# EAGLE design untitled (EAGLE 9.3.2)
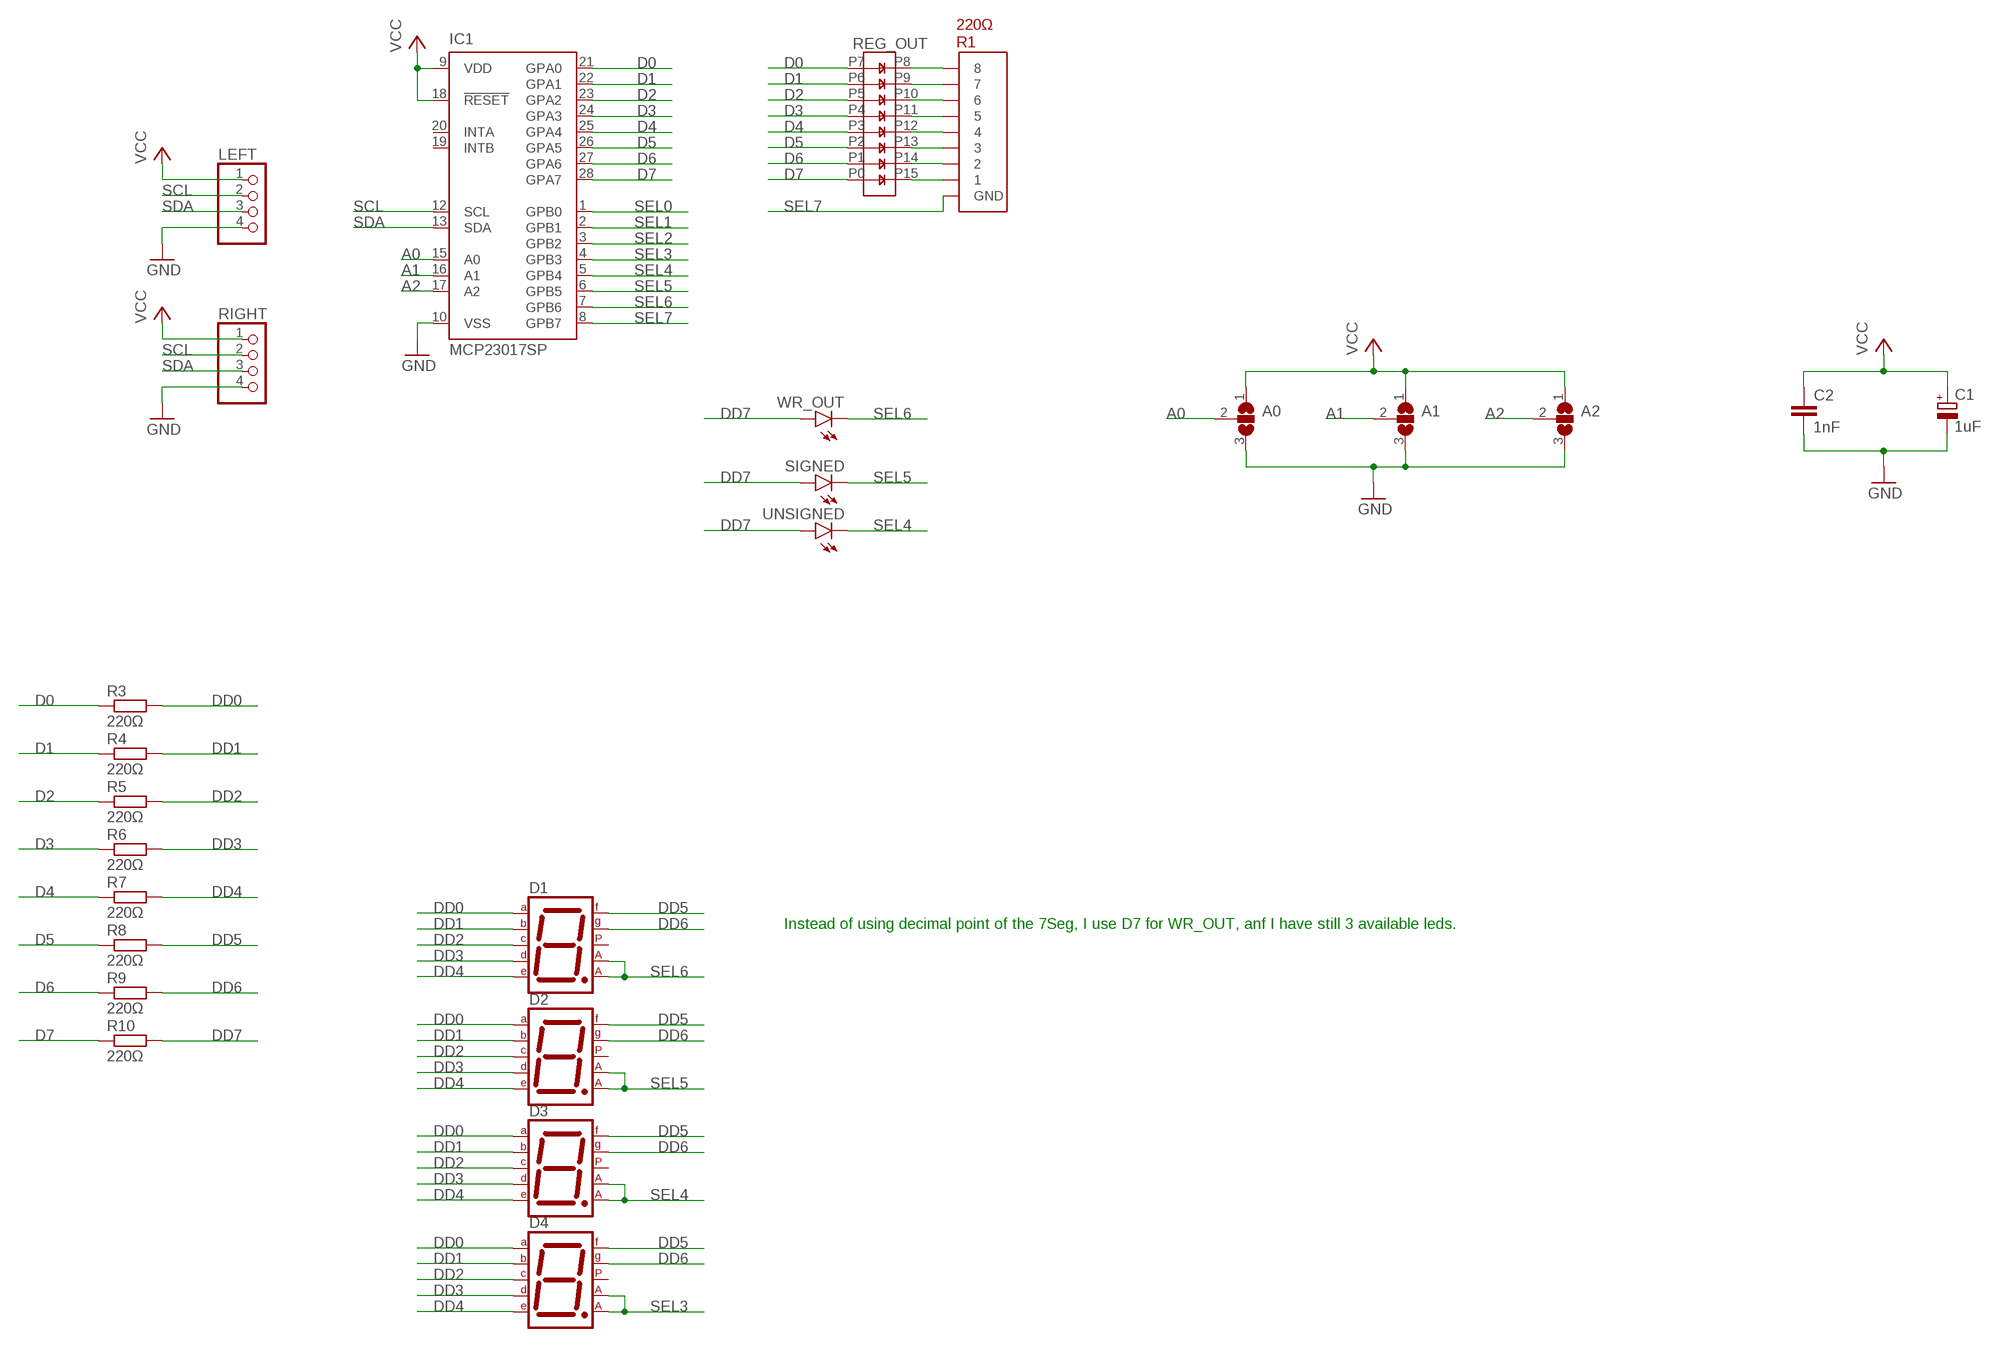
[diagram p0: schematic, sheet 1]

## Parts
A0  SJ2W  [SJ_2]
A1  SJ2W  [SJ_2]
A2  SJ2W  [SJ_2]
C1  1uF  CPOL-EUE2.5-6  [E2,5-6]
C2  1nF  C2.5/2  [C2.5-2]
D1  7SEG-CA  [7SEG-13]
D2  7SEG-CA  [7SEG-13]
D3  7SEG-CA  [7SEG-13]
D4  7SEG-CA  [7SEG-13]
IC1  MCP23017SP  [DIL28-3]
LEFT  PINHD-1X4  [1X04]
R1  220Ω  R_ARRAY_8PIN  [R_ARRAY_8PIN]
R3  220Ω  R-EU_0207/10  [0207/10]
R4  220Ω  R-EU_0207/10  [0207/10]
R5  220Ω  R-EU_0207/10  [0207/10]
R6  220Ω  R-EU_0207/10  [0207/10]
R7  220Ω  R-EU_0207/10  [0207/10]
R8  220Ω  R-EU_0207/10  [0207/10]
R9  220Ω  R-EU_0207/10  [0207/10]
R10  220Ω  R-EU_0207/10  [0207/10]
REG_OUT  LB8  [LB8]
RIGHT  PINHD-1X4  [1X04]
SIGNED  LED3MM  [LED3MM]
UNSIGNED  LED3MM  [LED3MM]
WR_OUT  LED3MM  [LED3MM]

## Nets
A0: A0.2 IC1.15(A0)
A1: A1.2 IC1.16(A1)
A2: A2.2 IC1.17(A2)
D0: IC1.21(GPA0) R3.1 REG_OUT.P7
D1: IC1.22(GPA1) R4.1 REG_OUT.P6
D2: IC1.23(GPA2) R5.1 REG_OUT.P5
D3: IC1.24(GPA3) R6.1 REG_OUT.P4
D4: IC1.25(GPA4) R7.1 REG_OUT.P3
D5: IC1.26(GPA5) R8.1 REG_OUT.P2
D6: IC1.27(GPA6) R9.1 REG_OUT.P1
D7: IC1.28(GPA7) R10.1 REG_OUT.P0
DD0: D1.7(A) D2.7(A) D3.7(A) D4.7(A) R3.2
DD1: D1.6(B) D2.6(B) D3.6(B) D4.6(B) R4.2
DD2: D1.4(C) D2.4(C) D3.4(C) D4.4(C) R5.2
DD3: D1.2(D) D2.2(D) D3.2(D) D4.2(D) R6.2
DD4: D1.1(E) D2.1(E) D3.1(E) D4.1(E) R7.2
DD5: D1.9(F) D2.9(F) D3.9(F) D4.9(F) R8.2
DD6: D1.10(G) D2.10(G) D3.10(G) D4.10(G) R9.2
DD7: R10.2 SIGNED.A UNSIGNED.A WR_OUT.A
GND: A0.3 A1.3 A2.3 C1.- C2.2 IC1.10(VSS) LEFT.4 RIGHT.4
N$17: R1.8 REG_OUT.P8
N$18: R1.7 REG_OUT.P9
N$19: R1.6 REG_OUT.P10
N$20: R1.5 REG_OUT.P11
N$21: R1.4 REG_OUT.P12
N$22: R1.3 REG_OUT.P13
N$23: R1.2 REG_OUT.P14
N$24: R1.1 REG_OUT.P15
SCL: IC1.12(SCL) LEFT.2 RIGHT.2
SDA: IC1.13(SDA) LEFT.3 RIGHT.3
SEL0: IC1.1(GPB0)
SEL1: IC1.2(GPB1)
SEL2: IC1.3(GPB2)
SEL3: D4.3(CA1) D4.8(CA2) IC1.4(GPB3)
SEL4: D3.3(CA1) D3.8(CA2) IC1.5(GPB4) UNSIGNED.K(C)
SEL5: D2.3(CA1) D2.8(CA2) IC1.6(GPB5) SIGNED.K(C)
SEL6: D1.3(CA1) D1.8(CA2) IC1.7(GPB6) WR_OUT.K(C)
SEL7: IC1.8(GPB7) R1.GND
VCC: A0.1 A1.1 A2.1 C1.+ C2.1 IC1.9(VDD) IC1.18(!RESET) LEFT.1 RIGHT.1
Unconnected: D1.5(DP) D2.5(DP) D3.5(DP) D4.5(DP) IC1.19(INTB) IC1.20(INTA)

## Notes on the sheet
- Instead of using decimal point of the 7Seg, I use D7 for WR_OUT, anf I have still 3 available leds.

## Library data of the parts
A0 A1 A2 = jumper:SJ2W: SMD solder JUMPER
C1 = rcl:CPOL-EU: POLARIZED CAPACITOR, European symbol; SPICEPREFIX: C
C2 = capacitor-wima:C: CAPACITOR naming: grid - package width
D1-D4 = special:7SEG-CA: 7-segment DISPLAY single anode, 13 mm
IC1 = microchip:MCP23017: http://ww1.microchip.com/downloads/en/DeviceDoc/21952a.pdf Source: http://ww1.microchip.com/downloads/en/DeviceDoc/21952a.pdf; MF: MICROCHIP; MPN: MCP23017-E/SP; OC_FARNELL: 1332088; OC_NEWARK: 31K2959
LEFT RIGHT = pinhead:PINHD-1X4: PIN HEADER
R1 = 8bit_components:R_ARRAY_8PIN
R3-R10 = rcl:R-EU_: RESISTOR, European symbol; SPICEPREFIX: R
REG_OUT = 8bit_components:LB8
SIGNED UNSIGNED WR_OUT = led:LED: LED OSRAM: - CHIPLED LG R971, LG N971, LY N971, LG Q971, LY Q971, LO R971, LY R971 LH N974, LH R974 LS Q976, LO Q976, LY Q976 LO Q996 - Hyper CHIPLED LW Q18S LB Q993, LB Q99A, LB R99A - SideLED LS A670, LO A670, LY A670, LG A670, LP A670 LB A673, LV A673, LT A673, LW A673 LH A674 LY A675 LS A676, LA A676, LO A676, LY A676, LW A676 LS A679, LY A679, LG A679 - Hyper Micro SIDELED® LS Y876, LA Y876, LO Y876, LY Y876 LT Y87S - SmartLED LW L88C, LW L88S LB L89C, LB L89S, LG L890 LS L89K, LO L89K, LY L89K LS L896, LA L896, LO L896, LY L896 - TOPLED LS T670, LO T670, LY T670, LG T670, LP T670 LSG T670, LSP T670, LSY T670, LOP T670, LYG T670 LG T671, LOG T671, LSG T671 LB T673, LV T673, LT T673, LW T673 LH T674 LS T676, LA T676, LO T676, LY T676, LB T676, LH T676, LSB T676, LW T676 LB T67C, LV T67C, LT T67C, LS T67K, LO T67K, LY T67K, LW E67C LS E67B, LA E67B, LO E67B, LY E67B, LB E67C, LV E67C, LT E67C LW T67C LS T679, LY T679, LG T679 LS T770, LO T770, LY T770, LG T770, LP T770 LB T773, LV T773, LT T773, LW T773 LH T774 LS E675, LA E675, LY E675, LS T675 LS T776, LA T776, LO T776, LY T776, LB T776 LHGB T686 LT T68C, LB T68C - Hyper Mini TOPLED® LB M676 - Mini TOPLED Santana® LG M470 LS M47K, LO M47K, LY M47K Source: http://www.osram.convergy.de LUXEON: - LUMILED® LXK2-PW12-R00, LXK2-PW12-S00, LXK2-PW14-U00, LXK2-PW14-V00 LXK2-PM12-R00, LXK2-PM12-S00, LXK2-PM14-U00 LXK2-PE12-Q00, LXK2-PE12-R00, LXK2-PE12-S00, LXK2-PE14-T00, LXK2-PE14-U00 LXK2-PB12-K00, LXK2-PB12-L00, LXK2-PB12-M00, LXK2-PB14-N00, LXK2-PB14-P00, LXK2-PB14-Q00 LXK2-PR12-L00, LXK2-PR12-M00, LXK2-PR14-Q00, LXK2-PR14-R00 LXK2-PD12-Q00, LXK2-PD12-R00, LXK2-PD12-S00 LXK2-PH12-R00, LXK2-PH12-S00 LXK2-PL12-P00, LXK2-PL12-Q00, LXK2-PL12-R00 Source: www.luxeon.com KINGBRIGHT: KA-3528ASYC Source: www.kingbright.com

## Board
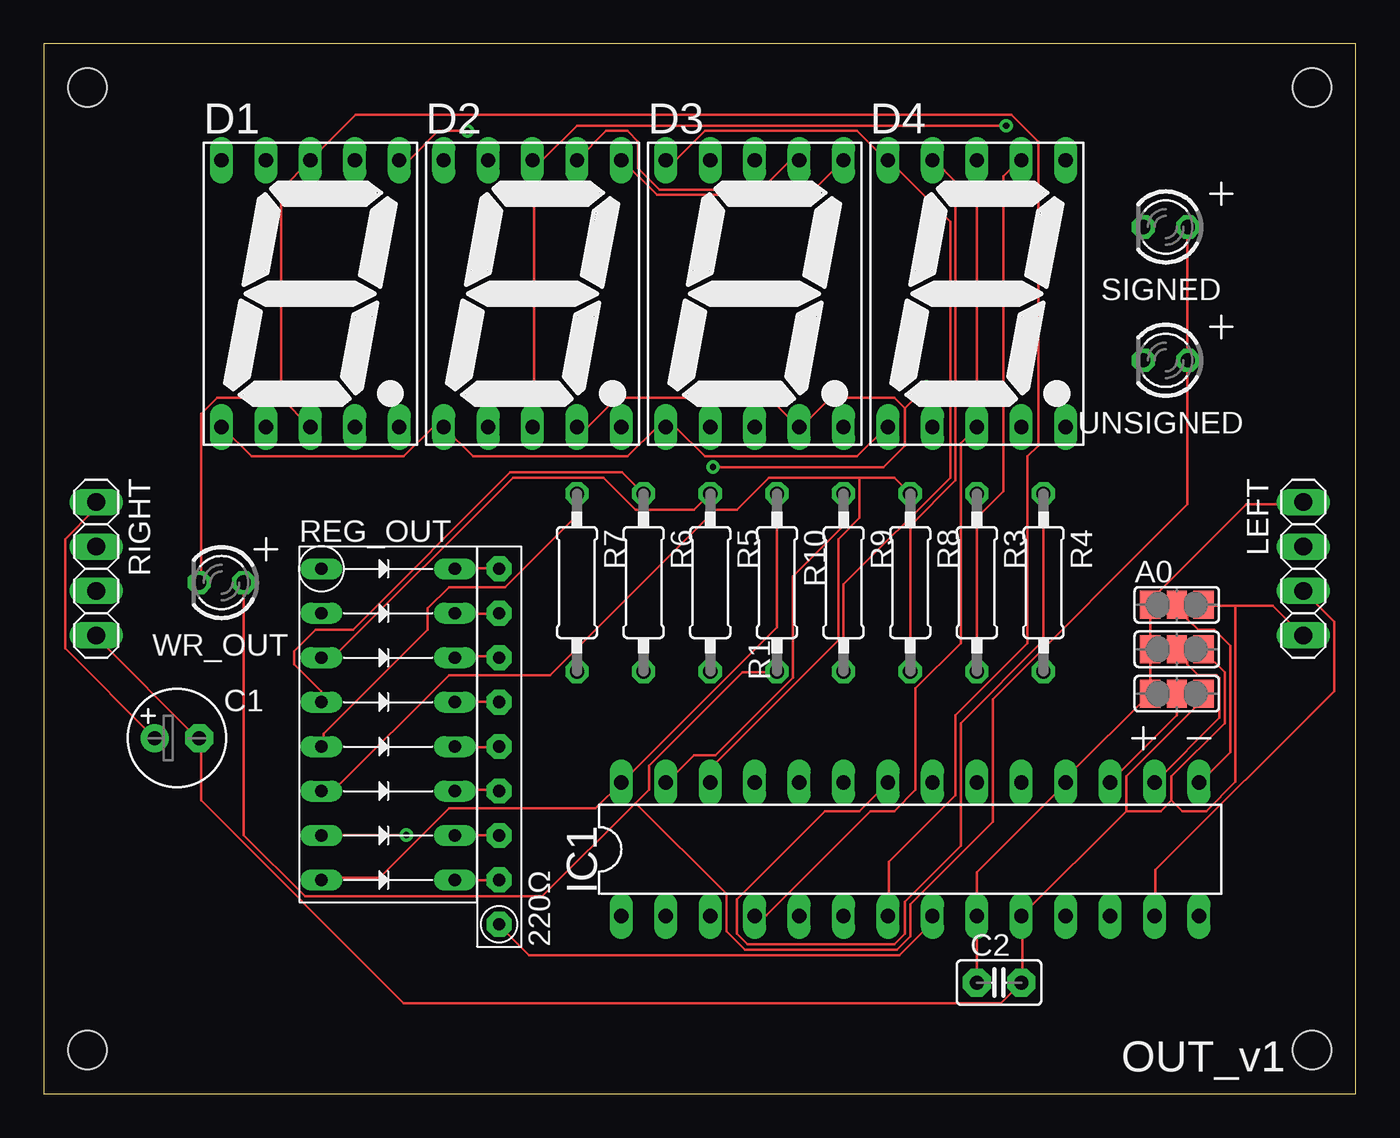
[diagram p1: board, top side]
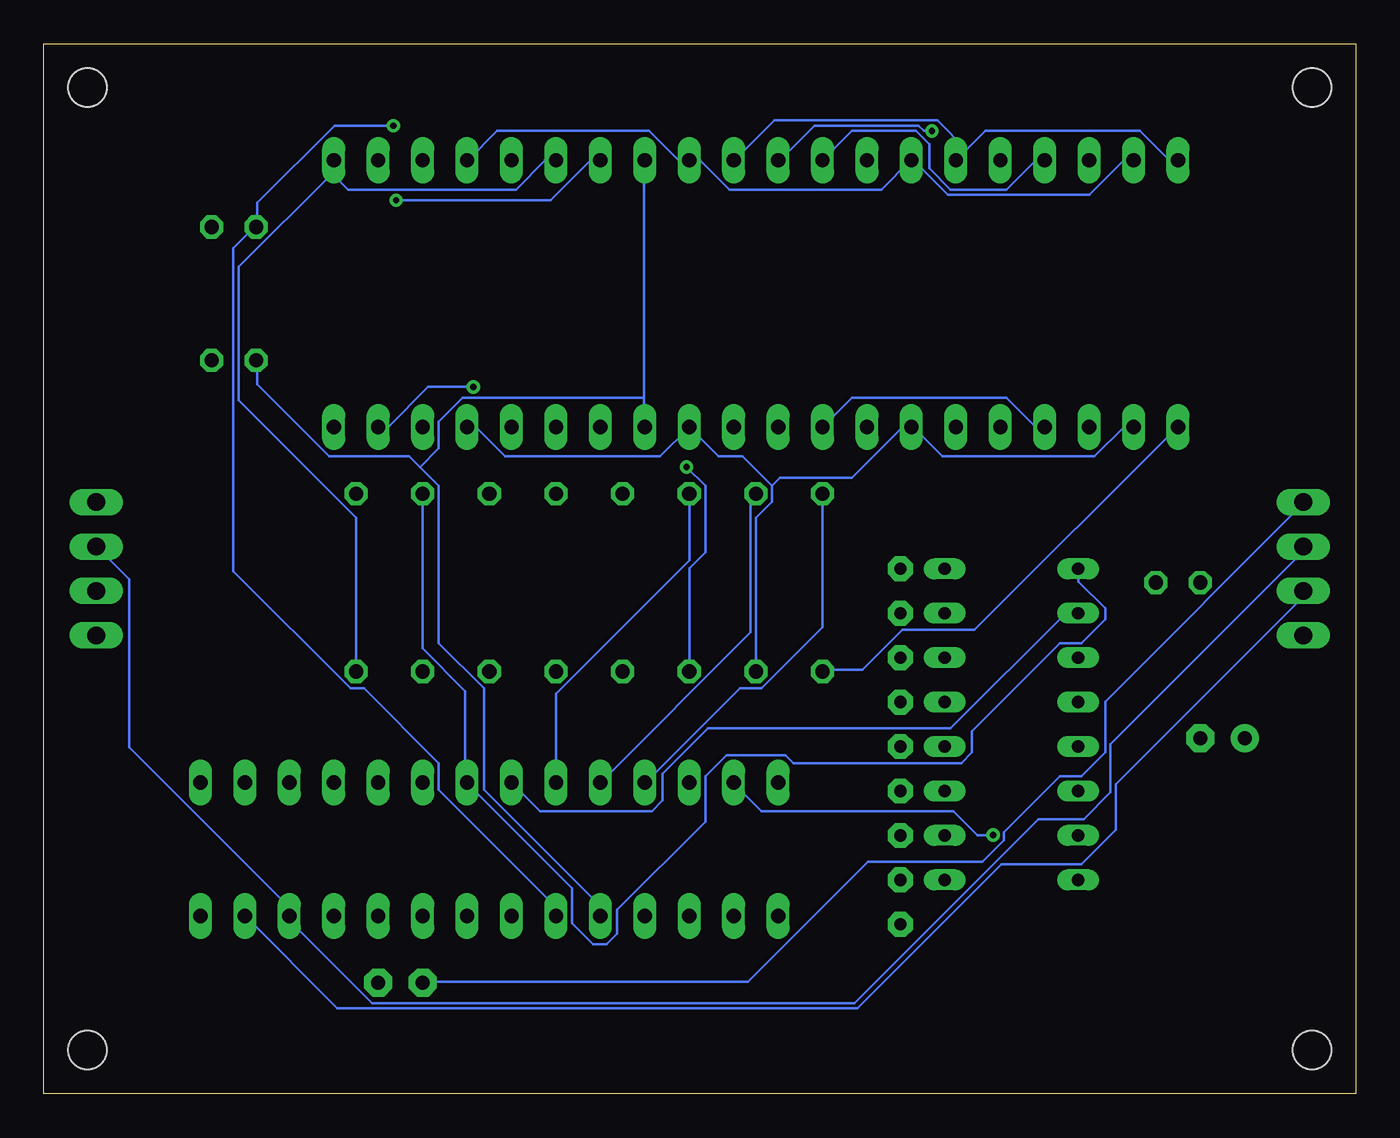
[diagram p2: board, bottom side, seen from below]

Size 75 x 60 mm. Coordinates in mm from the lower left corner, seen from the top.
Outline: 0,0 75,0 75,60 0,60 0,0
Copper layers (1*16): Top 0.035mm / dielectric 1.5mm / Bottom 0.035mm
Design rules "default": minimum track width 6mil, minimum drill 0.35mm, track to track 6mil, track to pad 6mil, pad to pad 6mil, via to via 6mil, smd to smd 6mil, copper to edge 40mil, drill to drill 6mil, minimum pad ring 10mil, minimum via ring 8mil, stop-mask expansion 4mil, vias tented up to drill 0mil, thermal gap 10mil
Holes 2.2 mm at 2.5,2.5 72.5,2.5 72.5,57.5 2.5,57.5
vRestrict: area 61,20.3 to 68.6,30.5

### Footprints (pad centres in the part's own frame; a part is rotated, then mirrored left to right if it is on the bottom)
SJ_2 = smd 1.168 x 1.6: 1 -1.524,0; 2 0,0; 3 1.524,0
E2,5-6 = drill 0.813 pad 1.6: + -1.27,0 | drill 0.813 pad 1.6 octagon: - 1.27,0
C2.5-2 = drill 0.813 pad 1.6 octagon: 1 -1.27,0; 2 1.27,0
7SEG-13 = drill 0.813 long: 1 -5.08,-7.62; 2 -2.54,-7.62; 3 0,-7.62; 4 2.54,-7.62; 5 5.08,-7.62; 6 5.08,7.62; 7 2.54,7.62; 8 0,7.62; 9 -2.54,7.62; 10 -5.08,7.62
DIL28-3 = drill 0.813 long: 1 -16.51,-3.81; 2 -13.97,-3.81; 3 -11.43,-3.81; 4 -8.89,-3.81; 5 -6.35,-3.81; 6 -3.81,-3.81; 7 -1.27,-3.81; 8 1.27,-3.81; 9 3.81,-3.81; 10 6.35,-3.81; 11 8.89,-3.81; 12 11.43,-3.81; 13 13.97,-3.81; 14 16.51,-3.81; 15 16.51,3.81; 16 13.97,3.81; 17 11.43,3.81; 18 8.89,3.81; 19 6.35,3.81; 20 3.81,3.81; 21 1.27,3.81; 22 -1.27,3.81; 23 -3.81,3.81; 24 -6.35,3.81; 25 -8.89,3.81; 26 -11.43,3.81; 27 -13.97,3.81; 28 -16.51,3.81
1X04 = drill 1.016 long: 1 -3.81,0; 2 -1.27,0; 3 1.27,0; 4 3.81,0
R_ARRAY_8PIN = drill 0.7 pad 1.422 octagon: 1 0,-7.62; 2 0,-5.08; 3 0,-2.54; 4 0,0; 5 0,2.54; 6 0,5.08; 7 0,7.62; 8 0,10.16; GND 0,-10.16
0207/10 = drill 0.813 octagon: 1 -5.08,0; 2 5.08,0
LB8 = drill 0.7 long: P0 -3.81,-8.89; P1 -3.81,-6.35; P2 -3.81,-3.81; P3 -3.81,-1.27; P4 -3.81,1.27; P5 -3.81,3.81; P6 -3.81,6.35; P7 -3.81,8.89; P8 3.81,8.89; P9 3.81,6.35; P10 3.81,3.81; P11 3.81,1.27; P12 3.81,-1.27; P13 3.81,-3.81; P14 3.81,-6.35; P15 3.81,-8.89
LED3MM = drill 0.813 octagon: A -1.27,0; K 1.27,0

### Placement (x,y rotation side)
A0  64.77,27.94 0 top
A1  64.77,25.4 0 top
A2  64.77,22.86 0 top
C1  7.62,20.32 0 top
C2  54.61,6.35 0 top
D1  15.24,45.72 0 top
D2  27.94,45.72 0 top
D3  40.64,45.72 0 top
D4  53.34,45.72 0 top
IC1  49.53,13.97 0 top
LEFT  72,30 270 top
R1  26.04,19.84 0 top
R3  53.34,29.21 270 top
R4  57.15,29.21 270 top
R5  38.1,29.21 270 top
R6  34.29,29.21 270 top
R7  30.48,29.21 270 top
R8  49.53,29.21 270 top
R9  45.72,29.21 270 top
R10  41.91,29.21 270 top
REG_OUT  19.68,21.11 0 top
RIGHT  3,30 270 top
SIGNED  64.14,49.53 180 top
UNSIGNED  64.14,41.91 180 top
WR_OUT  10.16,29.21 180 top

### Tracks (layer width: path | path; a pad name or v marks a point on that pad's centre or on a via)
A0
  Top 0.152: A0.2 64.77,27.89 65.38,27.28 65.38,27.13 65.99,26.52 66.9,26.52 67.82,25.6 67.82,19.51 66.14,17.83 IC1.15
A1
  Top 0.152: IC1.16 67.21,21.49 67.21,23.77 67.06,23.93 65.99,23.93 65.38,24.54 65.38,24.69 64.77,25.3 A1.2
A2
  Top 0.152: A2.2 64.77,21.64 60.96,17.83 IC1.17
D0
  Bottom 0.152: REG_OUT.P7 15.85,29.87 15.85,29.26 14.33,27.74 14.33,27.13 15.7,25.76 16.92,25.76 21.95,20.73 21.95,19.51 22.55,18.9 32.16,18.9 32.61,19.36 35.97,19.36 37.19,18.14 37.19,15.54 42.22,10.52 42.22,9.14 42.82,8.53 43.59,8.53 44.81,9.75 44.81,11.73 50.75,17.68 IC1.21 50.9,17.83 50.9,23.01 53.34,25.45 R3.1
D1
  Top 0.152: R4.1 57.15,25.91 52.43,21.18 52.43,14.17 49.23,10.97 49.23,9.14 48.62,8.53 40.23,8.53 39.62,9.14 39.62,11.12 44.65,16.15 46.63,16.15 IC1.22
  Bottom 0.152: IC1.22 46.63,16.15 40.23,16.15 39.62,16.76 39.62,18.29 37.03,20.88 23.16,20.88 16.61,27.43 16,27.43 REG_OUT.P6
D2
  Top 0.152: R5.1 37.19,33.38 33.83,33.38 32,35.2 26.82,35.2 16.61,24.99 16,24.99 REG_OUT.P5
  Bottom 0.152: IC1.23 45.72,22.86 38.1,30.48 R5.1
D3
  Top 0.152: R6.1 33.07,35.51 26.67,35.51 17.68,26.52 15.54,26.52 14.33,25.3 14.33,24.54 15.85,23.01 15.85,22.4 REG_OUT.P4
  Bottom 0.152: IC1.24 34.59,26.36 34.59,33.98 R6.1
D4
  Top 0.152: R7.1 30.48,33.07 26.36,28.96 23.16,28.96 21.95,27.74 21.95,26.52 16,20.57 16,19.96 REG_OUT.P3
  Bottom 0.152: R7.1 30.48,26.67 33.98,23.16 35.2,23.16 40.54,17.83 IC1.25
D5
  Top 0.152: 46.63,35.2 48.62,35.2 R8.1 | 46.63,35.2 41.45,35.2 39.62,33.38 38.41,33.38 28.96,23.93 23.16,23.93 16.61,17.37 16,17.37 REG_OUT.P2 | IC1.26 38.1,18.59 45.41,25.91 45.41,31.7 46.63,32.92 46.63,35.2
D6  (via drill 0.35)
  Top 0.152: v20.73,14.78 16,14.78 REG_OUT.P1 | R9.1 45.72,32.46 42.82,29.57 42.82,23.77 38.41,19.36 37.19,19.36 35.66,17.83 IC1.27
  Bottom 0.152: v20.73,14.78 21.64,14.78 23.01,16.15 33.98,16.15 35.51,17.68 IC1.27
D7
  Top 0.152: REG_OUT.P0 16,12.34 19.2,12.34 23.16,16.31 31.55,16.31 IC1.28 41.91,26.67 R10.1
DD0  (via drill 0.35)
  Top 0.152: D3.7 42.67,53.34 41,51.66 35.2,51.66 33.98,52.88 33.98,54.41 33.38,55.02 32.16,55.02 D2.7 | R3.2 53.34,32.92 54.86,34.44 v54.86,51.05 54.86,52.43 55.78,53.34 D4.7
  Bottom 0.152: D1.7 18.29,53.34 19.96,51.66 23.16,51.66 24.38,52.88 24.38,54.25 25.15,55.02 28.8,55.02 D2.7 | D3.7 43.74,53.34 46.02,51.05 v54.86,51.05
DD1  (via drill 0.35)
  Top 0.152: D1.6 20.88,53.34 22.55,55.02 v24.23,55.02 | D3.6 43.74,51.36 35.05,51.36 33.07,53.34 D2.6
  Bottom 0.152: v24.23,55.02 24.69,55.02 24.99,55.32 30.94,55.32 32.92,53.34 D2.6 | R4.2 57.15,32.92 63.86,39.62 63.86,47.24 58.52,52.58 | 58.52,52.58 58.52,53.34 D4.6 58.52,52.58 | D3.6 46.33,53.34 48.01,51.66 57.61,51.66 58.52,52.58
DD2  (via drill 0.35)
  Top 0.152: v38.25,35.81 48.01,35.81 49.23,37.03 49.23,39.17 | 49.23,39.17 48.62,39.78 44.96,39.78 43.28,38.1 D3.4 43.13,38.1 41.45,39.78 32.77,39.78 31.09,38.1 D2.4 | 49.23,39.17 v50.44,40.39
  Bottom 0.152: D1.4 18.29,38.1 19.96,39.78 28.8,39.78 D2.4 | R5.2 38.1,30.02 37.19,30.94 37.19,34.75 v38.25,35.81 | D4.4 55.32,38.1 53.03,40.39 v50.44,40.39
DD3
  Bottom 0.152: D1.2 13.26,38.1 14.94,36.42 23.62,36.42 25.3,38.1 D2.2 25.91,38.1 28.8,35.2 32.92,35.2 33.38,34.75 | R6.2 34.29,32.92 33.38,33.83 33.38,34.75 | 33.38,34.75 35.05,36.42 36.42,36.42 D3.2 39.78,36.42 48.62,36.42 50.29,38.1 D4.2
DD4
  Top 0.152: D4.1 48.16,38.1 46.48,36.42 37.8,36.42 36.12,38.1 D3.1 35.05,38.1 33.38,36.42 24.54,36.42 D2.1 22.25,38.1 20.57,36.42 11.89,36.42 10.21,38.1 D1.1
  Bottom 0.152: R7.2 30.48,24.23 28.19,24.23 25.91,26.52 21.79,26.52 10.21,38.1 D1.1
DD5
  Top 0.152: R8.2 49.53,32.46 52.12,35.05 52.12,52.12 50.9,53.34 D4.9
  Bottom 0.152: D1.9 13.26,53.34 15.24,51.36 23.32,51.36 25.3,53.34 D2.9 25.45,53.34 27.13,51.66 35.81,51.66 37.49,53.34 D3.9 38.71,53.34 40.39,55.02 49.07,55.02 50.75,53.34 D4.9
DD6
  Top 0.152: R9.2 45.72,29.11 51.82,35.2 51.82,49.84 48.31,53.34 D4.10 48.16,53.34 46.48,55.02 37.8,55.02 36.12,53.34 D3.10
  Bottom 0.152: D1.10 10.67,53.34 12.34,55.02 21.18,55.02 22.25,53.95 | 22.25,53.95 23.93,55.63 33.22,55.63 35.51,53.34 D3.10 | 22.25,53.95 D2.10
DD7
  Top 0.152: 65.38,41.91 65.38,49.53 SIGNED.A | WR_OUT.A 11.43,14.78 14.94,11.28 28.5,11.28 33.83,16.61 | 33.83,16.61 34.59,17.37 34.59,18.75 39.93,24.08 41.91,24.08 R10.2 | 65.38,41.91 65.38,33.68 54.25,22.55 54.25,15.54 49.53,10.82 49.53,8.99 48.77,8.23 40.08,8.23 39.01,9.3 39.01,11.43 33.83,16.61 | 65.38,41.91 UNSIGNED.A
GND
  Top 0.152: RIGHT.4 3.05,26.06 8.84,20.27 C1.- 8.99,20.27 8.99,16.76 20.57,5.18 54.71,5.18 C2.2 55.93,6.4 55.93,10.06 IC1.10 61.87,16.15 | 68.12,27.89 70.26,27.89 71.93,26.21 LEFT.4 | 68.12,27.89 66.29,27.89 A0.3 | A2.3 66.29,22.55 61.87,18.14 61.87,16.15 | 64.47,16.76 64.47,18.14 67.51,21.18 67.51,24.08 66.29,25.3 A1.3 | 64.47,16.76 63.86,16.15 61.87,16.15 | 68.12,27.89 68.12,17.83 66.45,16.15 65.08,16.15 64.47,16.76
N$17
  Top 0.152: REG_OUT.P8 23.62,30.02 25.91,30.02 R1.8
N$18
  Top 0.152: REG_OUT.P9 23.62,27.43 25.91,27.43 R1.7
N$19
  Top 0.152: REG_OUT.P10 23.62,24.99 25.91,24.99 R1.6
N$20
  Top 0.152: REG_OUT.P11 23.62,22.4 25.91,22.4 R1.5
N$21
  Top 0.152: REG_OUT.P12 23.62,19.81 25.91,19.81 R1.4
N$22
  Top 0.152: REG_OUT.P13 23.62,17.37 25.91,17.37 R1.3
N$23
  Top 0.152: REG_OUT.P14 23.62,14.78 25.91,14.78 R1.2
N$24
  Top 0.152: REG_OUT.P15 23.62,12.19 25.91,12.19 R1.1
SCL
  Bottom 0.152: LEFT.2 71.93,31.24 70.1,29.41 70.1,19.81 60.96,10.67 IC1.12 60.96,9.91 56.24,5.18 28.65,5.18 18.14,15.7 15.54,15.7 14.02,17.22 14.02,19.96 3.05,30.94 3.05,31.24 RIGHT.2
SDA
  Top 0.152: IC1.13 63.55,10.21 63.55,12.8 73.76,23.01 73.76,26.98 72.08,28.65 LEFT.3
  Bottom 0.152: IC1.13 58.22,4.88 28.5,4.88 20.27,13.11 15.7,13.11 13.72,15.09 13.72,17.68 3.05,28.35 3.05,28.65 RIGHT.3
SEL3
  Top 0.152: IC1.4 40.69,10.21 41.3,10.21 47.24,16.15 48.62,16.15 49.84,17.37 49.84,23.16 52.43,25.76 52.43,37.19 D4.3 D4.8
SEL4
  Bottom 0.152: 40.69,39.78 40.69,53.34 D3.8 | 40.69,39.78 40.69,38.1 D3.3 | 53.49,35.81 54.1,36.42 58.67,36.42 62.79,40.54 62.79,41.91 UNSIGNED.K | 53.49,35.81 52.43,34.75 52.43,25.76 49.84,23.16 49.84,17.37 43.28,10.82 43.28,10.21 IC1.5 | 40.69,39.78 51.05,39.78 52.43,38.41 52.43,36.88 53.49,35.81
SEL5  (via drill 0.35)
  Top 0.152: 28.04,53.34 28.04,38.1 D2.3 | 28.04,53.34 28.5,53.34 30.48,55.32 v55.02,55.32 | 28.04,53.34 D2.8
  Bottom 0.152: IC1.6 45.72,10.67 52.43,17.37 52.43,18.9 56.69,23.16 57.45,23.16 64.16,29.87 64.16,48.31 62.94,49.53 SIGNED.K 62.79,49.53 62.79,50.9 58.37,55.32 v55.02,55.32
SEL6
  Top 0.152: 13.56,39.78 9.91,39.78 8.99,38.86 8.99,29.26 WR_OUT.K | D1.3 13.56,39.78 | IC1.7 48.31,10.21 48.31,13.26 52.12,17.07 52.12,21.64 56.24,25.76 56.24,36.42 56.84,37.03 56.84,54.41 55.32,55.93 17.83,55.93 D1.8 13.56,51.66 13.56,39.78
SEL7
  Top 0.152: IC1.8 50.75,10.06 50.75,9.75 48.92,7.92 27.74,7.92 26.06,9.6 R1.GND
VCC
  Top 0.152: C1.+ 1.22,25.45 1.22,31.7 2.9,33.38 2.9,33.68 RIGHT.1 | C2.1 IC1.9 53.34,12.65 58.37,17.68 IC1.18 58.52,17.83 58.52,18.14 A2.1 A1.1 A0.1 63.25,28.19 68.73,33.68 71.93,33.68 LEFT.1
  Bottom 0.152: RIGHT.1 3.05,33.68 14.33,22.4 14.33,19.51 15.7,18.14 16.92,18.14 20.12,14.94 20.12,14.48 21.34,13.26 27.89,13.26 34.75,6.4 53.34,6.4 C2.1

### Text on the board
tPlace: OUT_v1